# EAGLE design ESP32_LS7366 (EAGLE 9.6.2)
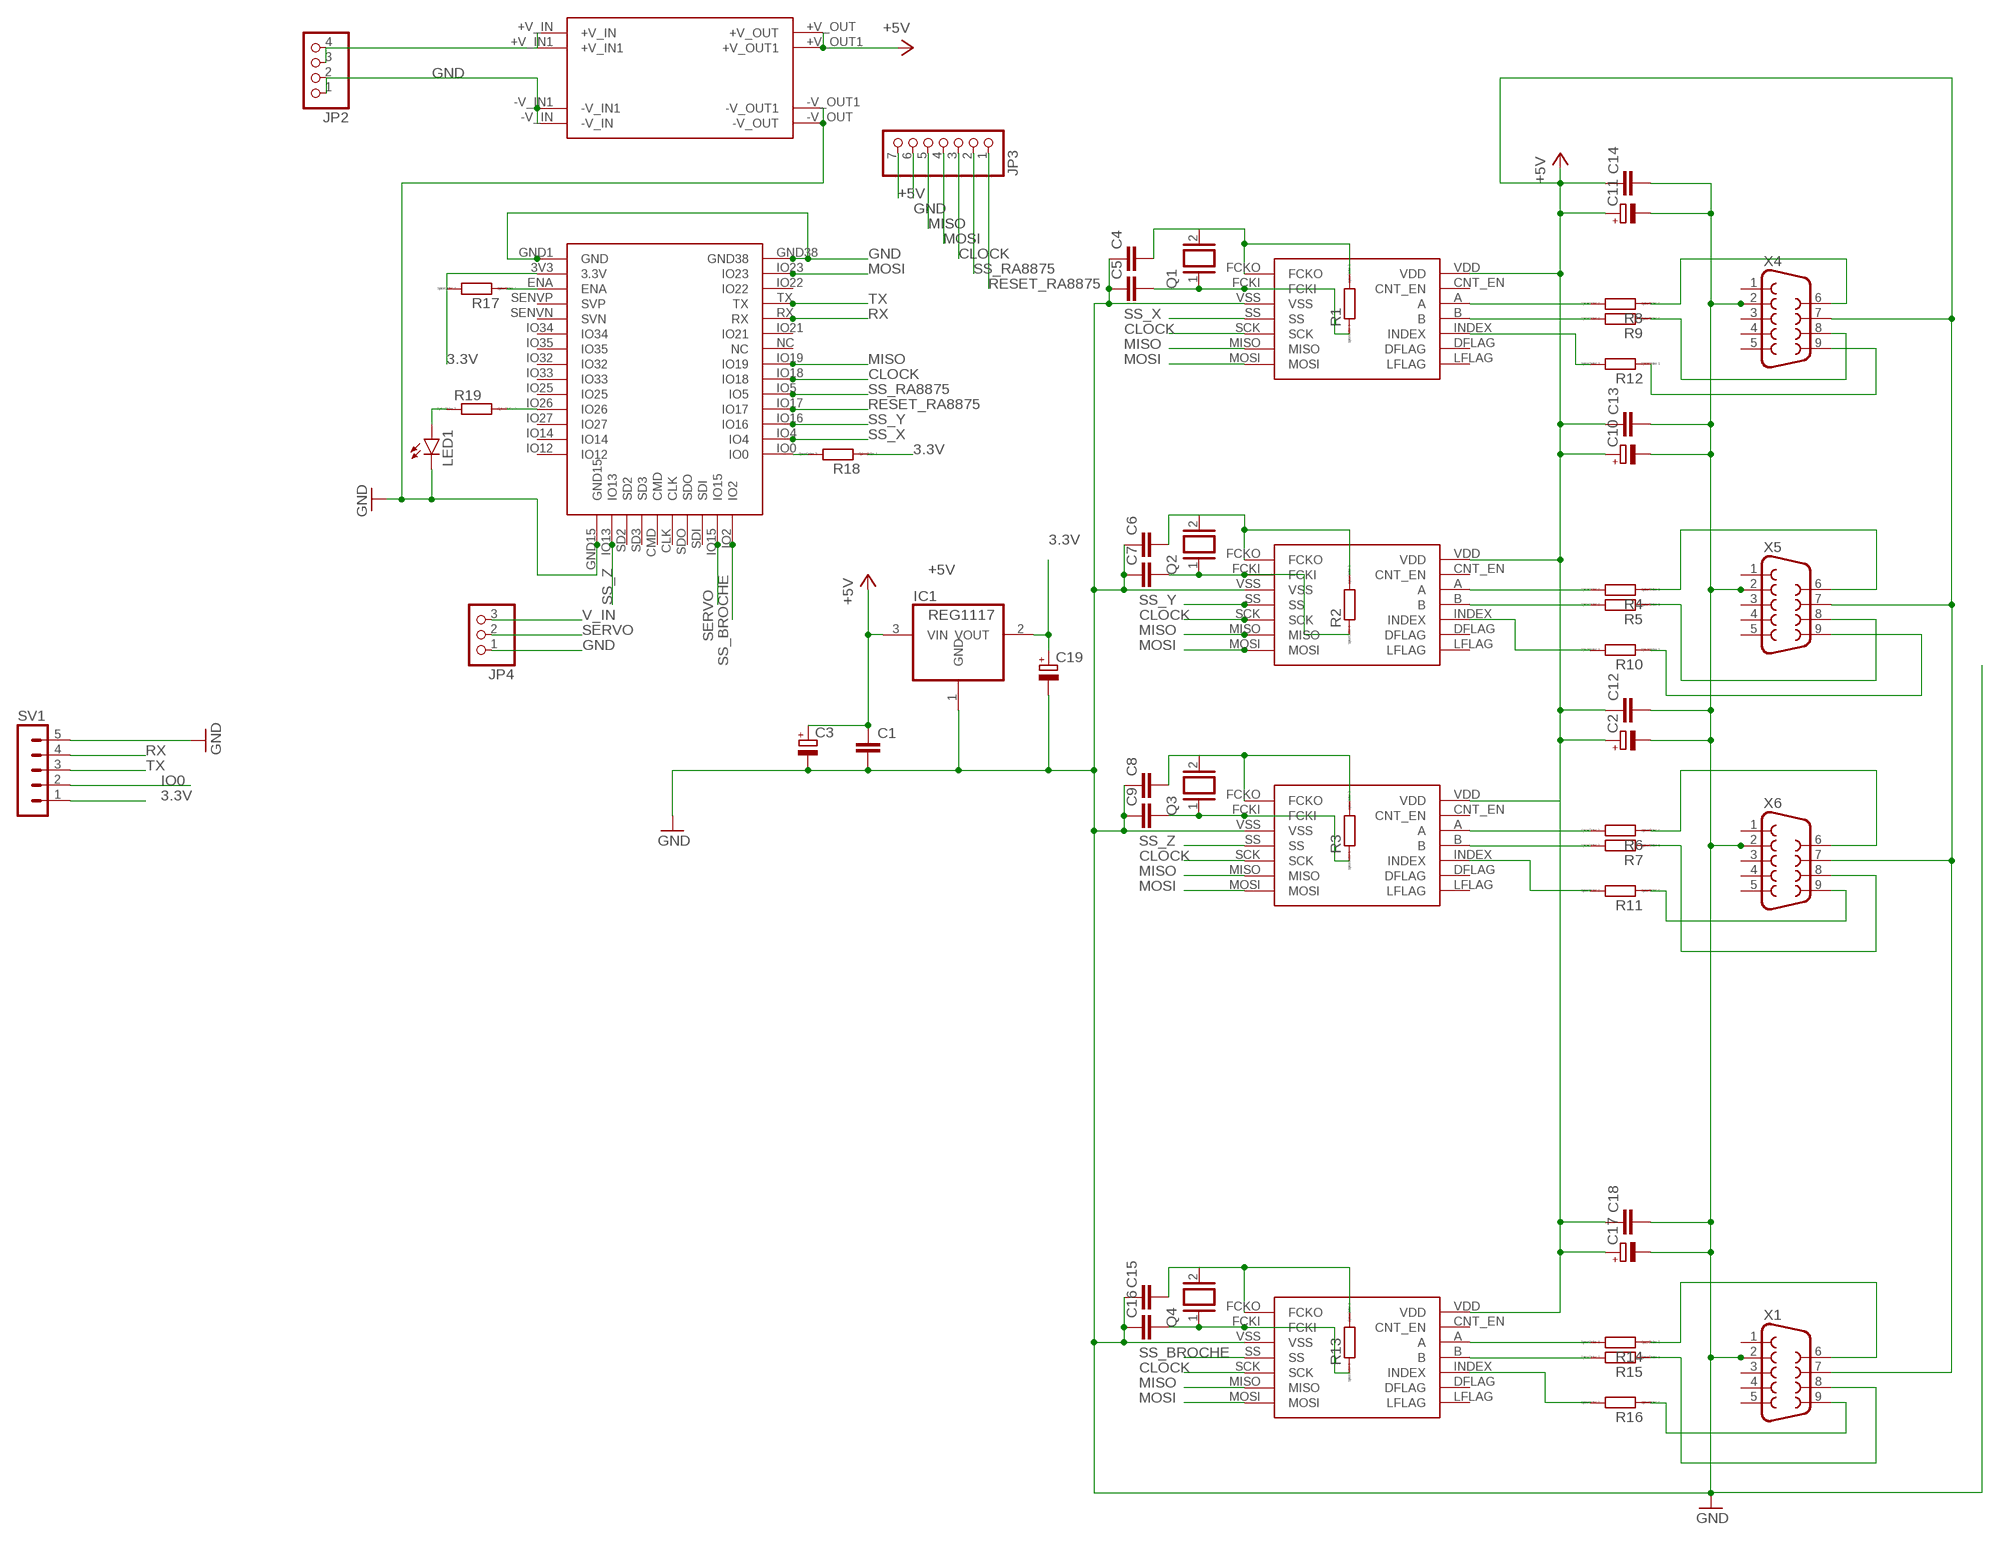
[diagram p0: schematic, sheet 1]

## Parts
C1  C-EU050-035X075  [C050-035X075]
C2  CPOL-EUE5-5  [E5-5]
C3  CPOL-EUE5-5  [E5-5]
C4  C2.5/5  [C2.5-5]
C5  C2.5/5  [C2.5-5]
C6  C2.5/5  [C2.5-5]
C7  C2.5/5  [C2.5-5]
C8  C2.5/5  [C2.5-5]
C9  C2.5/5  [C2.5-5]
C10  CPOL-EUE5-5  [E5-5]
C11  CPOL-EUE5-5  [E5-5]
C12  C-EU050-035X075  [C050-035X075]
C13  C-EU050-035X075  [C050-035X075]
C14  C-EU050-035X075  [C050-035X075]
C15  C2.5/5  [C2.5-5]
C16  C2.5/5  [C2.5-5]
C17  CPOL-EUE5-5  [E5-5]
C18  C-EU050-035X075  [C050-035X075]
C19  CPOL-EUE5-5  [E5-5]
IC1  REG1117  [SOT223]
JP2  PINHD-1X4  [1X04]
JP3  PINHD-1X7  [1X07]
JP4  PINHD-1X3  [1X03]
LED1  LED3MM  [LED3MM]
Q1  XTAL/S  [QS]
Q2  XTAL/S  [QS]
Q3  XTAL/S  [QS]
Q4  XTAL/S  [QS]
R1  R-EU_0207_10  [0207/10]
R2  R-EU_0207_10  [0207/10]
R3  R-EU_0207_10  [0207/10]
R4  R-EU_0207_10  [0207/10]
R5  R-EU_0207_10  [0207/10]
R6  R-EU_0207_10  [0207/10]
R7  R-EU_0207_10  [0207/10]
R8  R-EU_0207_10  [0207/10]
R9  R-EU_0207_10  [0207/10]
R10  R-EU_0207_10  [0207/10]
R11  R-EU_0207_10  [0207/10]
R12  R-EU_0207_10  [0207/10]
R13  R-EU_0207_10  [0207/10]
R14  R-EU_0207_10  [0207/10]
R15  R-EU_0207_10  [0207/10]
R16  R-EU_0207_10  [0207/10]
R17  R-EU_0207_10  [0207/10]
R18  R-EU_0207_10  [0207/10]
R19  R-EU_0207_10  [0207/10]
SV1  MA05-1  [MA05-1]
U$1  LS7366  [DIP14]
U$2  LS7366  [DIP14]
U$3  LS7366  [DIP14]
U$4  LS7366  [DIP14]
U$5  MODULE5V  [MODULE5V]
U$6  ESP32MODULE  [ESP32-MODULE]
X1  F09HP  [F09HP]
X4  F09HP  [F09HP]
X5  F09HP  [F09HP]
X6  F09HP  [F09HP]

## Nets
3.3V: C19.+ IC1.2(VOUT) R17.2 R18.1 SV1.1 U$6.3V3(3.3V)
+5V: C1.1 C2.+ C3.+ C10.+ C11.+ C12.1 C13.1 C14.1 C17.+ C18.1 IC1.3(VIN) JP3.7 U$1.VDD U$2.VDD U$3.VDD U$4.VDD U$5.+V_OUT U$5.+V_OUT1 X1.7 X4.7 X5.7 X6.7
CLOCK: JP3.3 U$1.SCK U$2.SCK U$3.SCK U$4.SCK U$6.IO18
GND: C1.2 C2.- C3.- C4.1 C5.1 C6.1 C7.1 C8.1 C9.1 C10.- C11.- C12.2 C13.2 C14.2 C15.1 C16.1 C17.- C18.2 C19.- IC1.1(GND) JP2.1 JP2.2 JP3.6 JP4.1 LED1.K(C) SV1.5 U$1.VSS U$2.VSS U$3.VSS U$4.VSS U$5.-V_IN U$5.-V_IN1 U$5.-V_OUT U$5.-V_OUT1 U$6.GND1(GND) U$6.GND15 U$6.GND38 X1.2 X4.2 X5.2 X6.2
IO0: R18.2 SV1.2 U$6.IO0
MISO: JP3.5 U$1.MISO U$2.MISO U$3.MISO U$4.MISO U$6.IO19
MOSI: JP3.4 U$1.MOSI U$2.MOSI U$3.MOSI U$4.MOSI U$6.IO23
N$1: R4.1 X5.6
N$2: R19.2 U$6.IO26
N$3: C7.2 Q2.1 R2.1 U$3.FCKI
N$4: LED1.A R19.1
N$5: C9.2 Q3.1 R3.1 U$4.FCKI
N$6: R6.1 X6.6
N$7: R7.1 X6.8
N$8: R5.1 X5.8
N$10: C5.2 Q1.1 R1.1 U$2.FCKI
N$11: R8.1 X4.6
N$12: R9.1 X4.8
N$13: R8.2 U$2.A
N$14: R7.2 U$4.B
N$15: R4.2 U$3.A
N$16: R5.2 U$3.B
N$19: C4.2 Q1.2 R1.2 U$2.FCKO
N$20: C6.2 Q2.2 R2.2 U$3.FCKO
N$21: C8.2 Q3.2 R3.2 U$4.FCKO
N$38: R12.2 U$2.INDEX
N$39: R12.1 X4.9
N$40: R10.2 U$3.INDEX
N$41: R10.1 X5.9
N$42: R11.2 U$4.INDEX
N$43: R11.1 X6.9
N$50: R6.2 U$4.A
N$51: R9.2 U$2.B
N$52: C16.2 Q4.1 R13.1 U$1.FCKI
N$53: R14.1 X1.6
N$54: R15.1 X1.8
N$55: R15.2 U$1.B
N$56: C15.2 Q4.2 R13.2 U$1.FCKO
N$57: R16.2 U$1.INDEX
N$58: R16.1 X1.9
N$59: R14.2 U$1.A
N$61: R17.1 U$6.ENA
RESET_RA8875: JP3.1 U$6.IO17
RX: SV1.4 U$6.RX
SERVO: JP4.2 U$6.IO15
SS_BROCHE: U$1.SS U$6.IO2
SS_RA8875: JP3.2 U$6.IO5
SS_X: U$2.SS U$6.IO4
SS_Y: U$3.SS U$6.IO16
SS_Z: U$4.SS U$6.IO13
TX: SV1.3 U$6.TX
V_IN: JP2.3 JP2.4 JP4.3 U$5.+V_IN U$5.+V_IN1
Unconnected: U$1.CNT_EN U$1.DFLAG U$1.LFLAG U$2.CNT_EN U$2.DFLAG U$2.LFLAG U$3.CNT_EN U$3.DFLAG U$3.LFLAG U$4.CNT_EN U$4.DFLAG U$4.LFLAG U$6.CLK U$6.CMD U$6.IO12 U$6.IO14 U$6.IO21 U$6.IO22 U$6.IO25 U$6.IO27 U$6.IO32 U$6.IO33 U$6.IO34 U$6.IO35 U$6.NC U$6.SD2 U$6.SD3 U$6.SDI U$6.SDO U$6.SENVN(SVN) U$6.SENVP(SVP) X1.1 X1.3 X1.4 X1.5 X4.1 X4.3 X4.4 X4.5 X5.1 X5.3 X5.4 X5.5 X6.1 X6.3 X6.4 X6.5

## Library data of the parts
C1 C12-C14 C18 = rcl:C-EU: CAPACITOR, European symbol; SPICEPREFIX: C
C2 C3 C10 C11 C17 C19 = rcl:CPOL-EU: POLARIZED CAPACITOR, European symbol; SPICEPREFIX: C
C4-C9 C15 C16 = capacitor-wima:C: CAPACITOR naming: grid - package width
IC1 = burr-brown:REG1117: 800mA and 1A Low Dropout (LDO) Positive Regulator 1.8V, 2.5V, 2.85V, 3.3V, 5V, and Adj; MPN: REG1117; OC_FARNELL: 1097566; OC_NEWARK: 14P6981
JP2 = pinhead:PINHD-1X4: PIN HEADER
JP3 = pinhead:PINHD-1X7: PIN HEADER
JP4 = pinhead:PINHD-1X3: PIN HEADER
LED1 = led:LED: LED OSRAM: - CHIPLED LG R971, LG N971, LY N971, LG Q971, LY Q971, LO R971, LY R971 LH N974, LH R974 LS Q976, LO Q976, LY Q976 LO Q996 - Hyper CHIPLED LW Q18S LB Q993, LB Q99A, LB R99A - SideLED LS A670, LO A670, LY A670, LG A670, LP A670 LB A673, LV A673, LT A673, LW A673 LH A674 LY A675 LS A676, LA A676, LO A676, LY A676, LW A676 LS A679, LY A679, LG A679 - Hyper Micro SIDELED® LS Y876, LA Y876, LO Y876, LY Y876 LT Y87S - SmartLED LW L88C, LW L88S LB L89C, LB L89S, LG L890 LS L89K, LO L89K, LY L89K LS L896, LA L896, LO L896, LY L896 - TOPLED LS T670, LO T670, LY T670, LG T670, LP T670 LSG T670, LSP T670, LSY T670, LOP T670, LYG T670 LG T671, LOG T671, LSG T671 LB T673, LV T673, LT T673, LW T673 LH T674 LS T676, LA T676, LO T676, LY T676, LB T676, LH T676, LSB T676, LW T676 LB T67C, LV T67C, LT T67C, LS T67K, LO T67K, LY T67K, LW E67C LS E67B, LA E67B, LO E67B, LY E67B, LB E67C, LV E67C, LT E67C LW T67C LS T679, LY T679, LG T679 LS T770, LO T770, LY T770, LG T770, LP T770 LB T773, LV T773, LT T773, LW T773 LH T774 LS E675, LA E675, LY E675, LS T675 LS T776, LA T776, LO T776, LY T776, LB T776 LHGB T686 LT T68C, LB T68C - Hyper Mini TOPLED® LB M676 - Mini TOPLED Santana® LG M470 LS M47K, LO M47K, LY M47K Source: http://www.osram.convergy.de LUXEON: - LUMILED® LXK2-PW12-R00, LXK2-PW12-S00, LXK2-PW14-U00, LXK2-PW14-V00 LXK2-PM12-R00, LXK2-PM12-S00, LXK2-PM14-U00 LXK2-PE12-Q00, LXK2-PE12-R00, LXK2-PE12-S00, LXK2-PE14-T00, LXK2-PE14-U00 LXK2-PB12-K00, LXK2-PB12-L00, LXK2-PB12-M00, LXK2-PB14-N00, LXK2-PB14-P00, LXK2-PB14-Q00 LXK2-PR12-L00, LXK2-PR12-M00, LXK2-PR14-Q00, LXK2-PR14-R00 LXK2-PD12-Q00, LXK2-PD12-R00, LXK2-PD12-S00 LXK2-PH12-R00, LXK2-PH12-S00 LXK2-PL12-P00, LXK2-PL12-Q00, LXK2-PL12-R00 Source: www.luxeon.com KINGBRIGHT: KA-3528ASYC Source: www.kingbright.com
Q1-Q4 = special:XTAL/S: CRYSTAL
R1-R19 = resistor:R-EU_: RESISTOR, European symbol; SPICEPREFIX: R
SV1 = con-lstb:MA05-1: PIN HEADER; OC_FARNELL: unknown; OC_NEWARK: unknown
U$1-U$4 = ls7366:LS7366
U$5 = STM32:MODULE5V
U$6 = ESP32-DEVKITC:ESP32MODULE
X1 X4-X6 = con-subd:F09: SUB-D; OC_FARNELL: unknown; OC_NEWARK: unknown

## Board
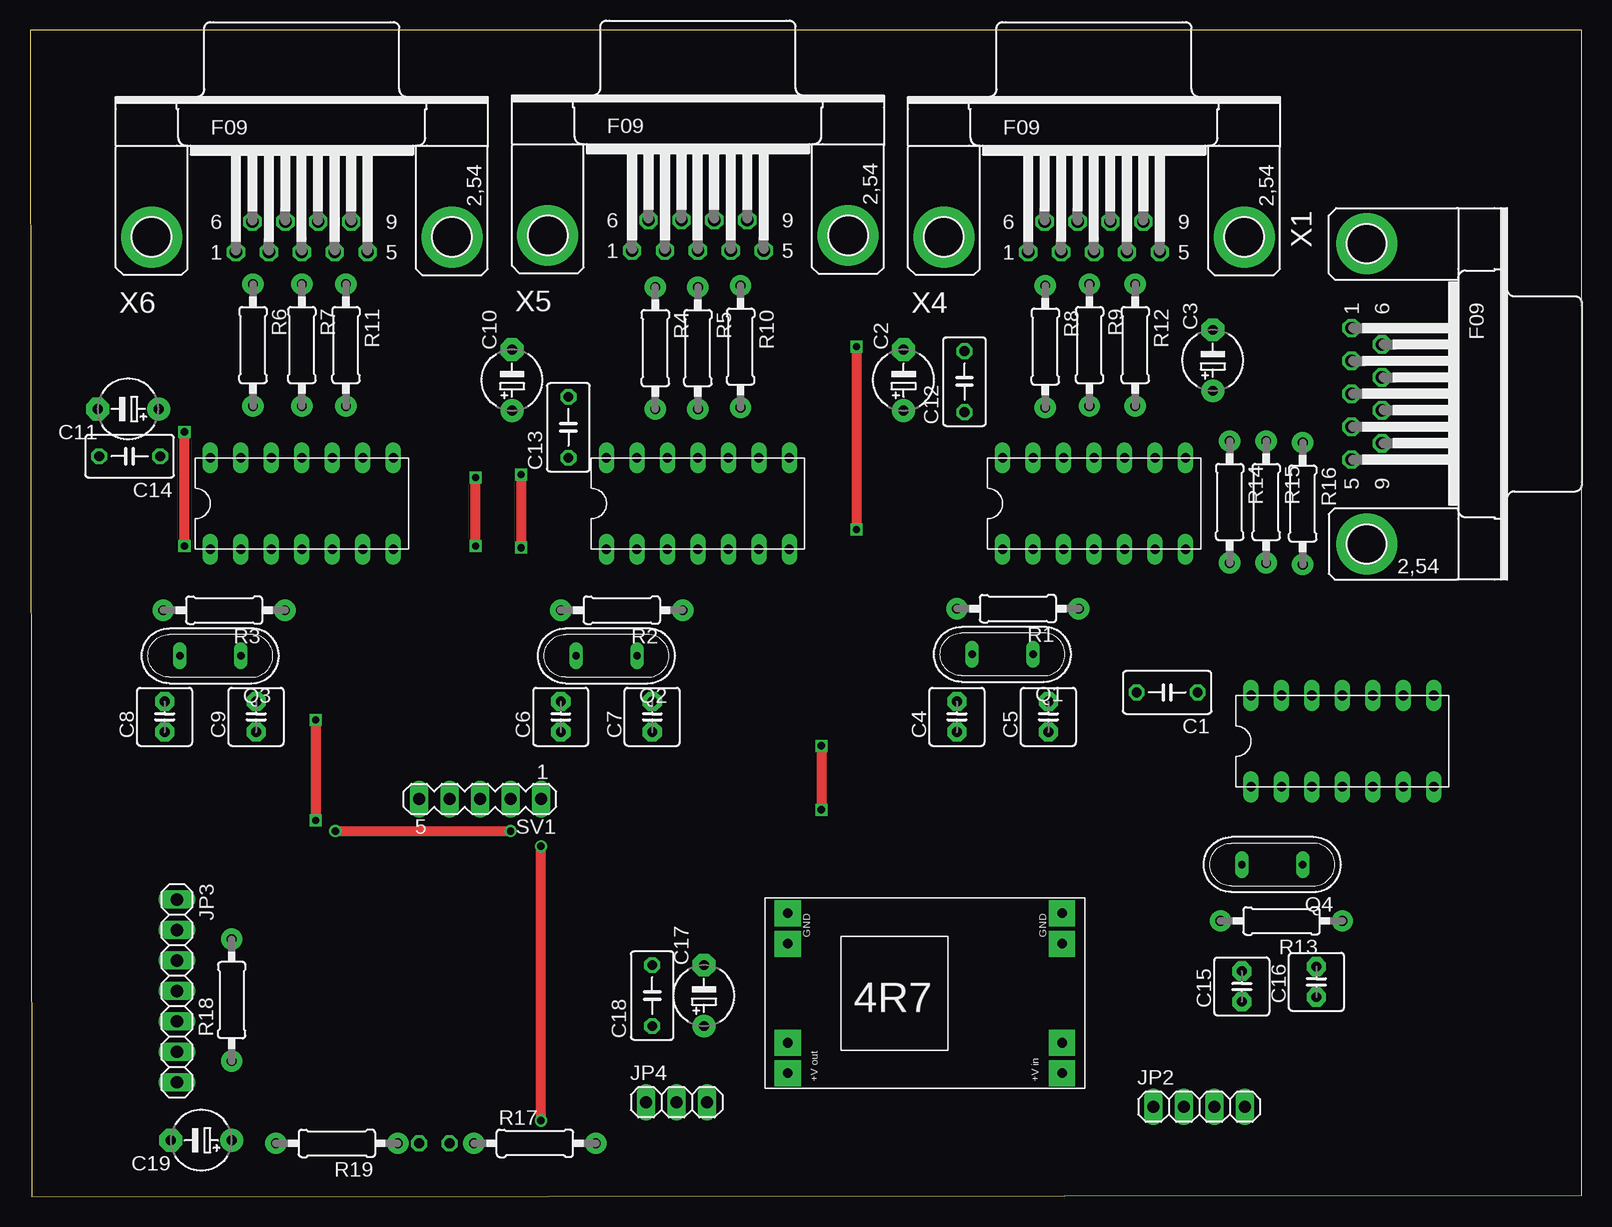
[diagram p1: board, top side]
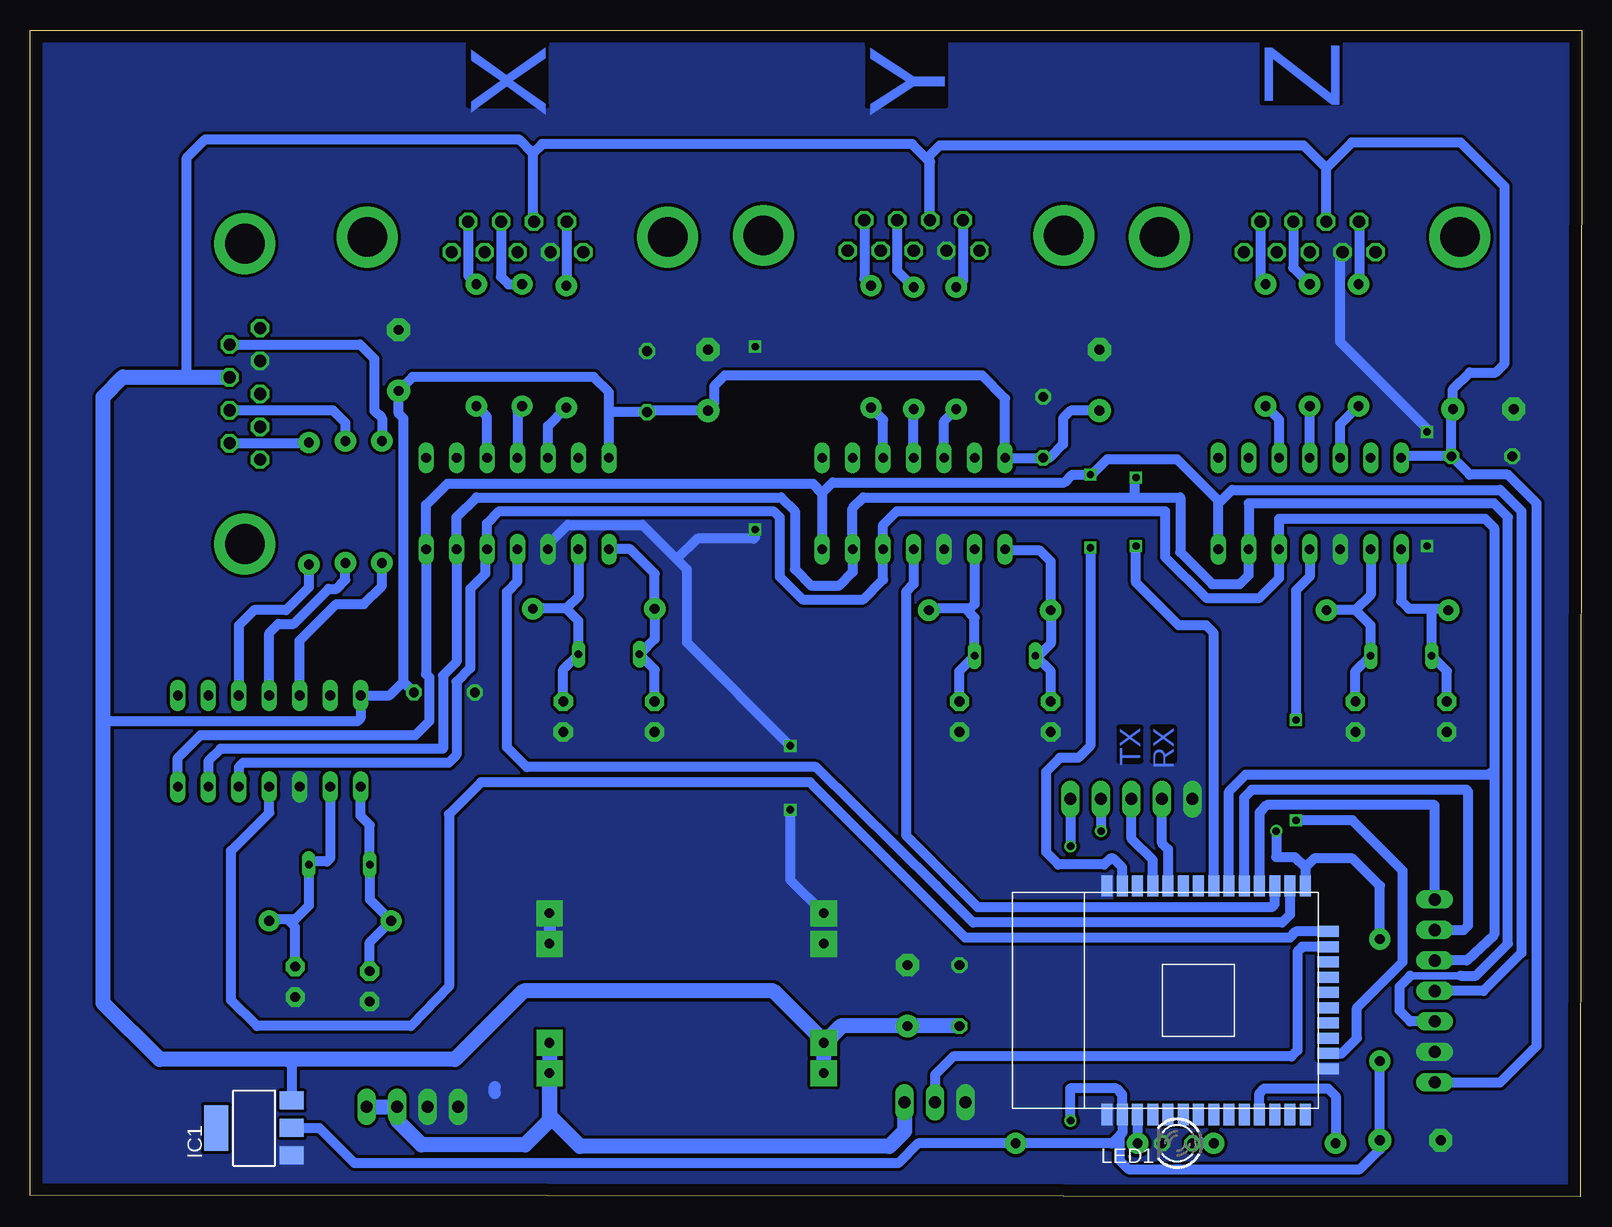
[diagram p2: board, bottom side, seen from below]

Size 129.34 x 97.26 mm. Coordinates in mm from the lower left corner, seen from the top.
Outline: 129.34,0.13 129.34,97.26 0,97.26 0.13,0 129.34,0.13
Copper layers (1*16): Top 0.035mm / dielectric 1.5mm / Bottom 0.035mm
Design rules "ESP32_LS7366": minimum track width 10mil, minimum drill 24mil, track to track 0.205mm, track to pad 0.205mm, pad to pad 0.205mm, via to via 0.205mm, smd to smd 8mil, copper to edge 40mil, drill to drill 8mil, minimum pad ring 10mil, minimum via ring 8mil, stop-mask expansion 4mil, vias tented up to drill 0mil, thermal gap 10mil

### Footprints (pad centres in the part's own frame; a part is rotated, then mirrored left to right if it is on the bottom)
C050-035X075 = drill 0.813 octagon: 1 -2.54,0; 2 2.54,0
E5-5 = drill 0.813 pad 1.905: + -2.54,0 | drill 0.813 pad 1.905 octagon: - 2.54,0
C2.5-5 = drill 0.813 pad 1.6 octagon: 1 -1.27,0; 2 1.27,0
SOT223 = smd 1.499 x 2.007: 1 -2.261,-3.15; 2 0.025,-3.15; 3 2.311,-3.15 | smd 3.81 x 2.007: 4 0,3.15
1X04 = drill 1.016 long: 1 -3.81,0; 2 -1.27,0; 3 1.27,0; 4 3.81,0
1X07 = drill 1.016 long: 1 -7.62,0; 2 -5.08,0; 3 -2.54,0; 4 0,0; 5 2.54,0; 6 5.08,0; 7 7.62,0
1X03 = drill 1.016 long: 1 -2.54,0; 2 0,0; 3 2.54,0
LED3MM = drill 0.813 octagon: A -1.27,0; K 1.27,0
QS = drill 0.61 long: 1 -2.54,0; 2 2.54,0
0207/10 = drill 0.813 pad 1.778: 1 -5.08,0; 2 5.08,0
MA05-1 = drill 1.016 long: 1 -5.08,0; 2 -2.54,0; 3 0,0; 4 2.54,0; 5 5.08,0
DIP14 = drill 0.8 long: A 5.08,5.08; B 7.62,5.08; CNT_EN 2.54,5.08; DFLAG 12.7,5.08; FCKI 2.54,-2.54; FCKO 0,-2.54; INDEX 10.16,5.08; LFLAG 15.24,5.08; MISO 12.7,-2.54; MOSI 15.24,-2.54; SCK 10.16,-2.54; SS 7.62,-2.54; VDD 0,5.08; VSS 5.08,-2.54
MODULE5V = drill 0.8 pad 2.184 square: +V_IN 1.905,-1.27; +V_IN1 1.905,-3.81; +V_OUT 24.765,-1.27; +V_OUT1 24.765,-3.81; -V_IN 1.905,-12.065; -V_IN1 1.905,-14.605; -V_OUT 24.765,-12.065; -V_OUT1 24.765,-14.605
ESP32-MODULE = smd 1.778 x 0.914: 3V3 -9.525,6.35; ENA -9.525,5.08; GND1 -9.525,7.62; GND38 9.525,7.62; IO0 9.525,-8.89; IO4 9.525,-7.62; IO5 9.525,-3.81; IO12 -9.525,-8.89; IO14 -9.525,-7.62; IO16 9.525,-6.35; IO17 9.525,-5.08; IO18 9.525,-2.54; IO19 9.525,-1.27; IO21 9.525,1.27; IO22 9.525,5.08; IO23 9.525,6.35; IO25 -9.525,-3.81; IO26 -9.525,-5.08; IO27 -9.525,-6.35; IO32 -9.525,-1.27; IO33 -9.525,-2.54; IO34 -9.525,1.27; IO35 -9.525,0; NC 9.525,0; RX 9.525,2.54; SENVN -9.525,2.54; SENVP -9.525,3.81; TX 9.525,3.81 | smd 0.914 x 1.778: CLK 0.635,-10.795; CMD -0.635,-10.795; GND15 -5.715,-10.795; IO2 5.715,-10.795; IO13 -4.445,-10.795; IO15 4.445,-10.795; SD2 -3.175,-10.795; SD3 -1.905,-10.795; SDI 3.175,-10.795; SDO 1.905,-10.795
F09HP = drill 1.016 octagon: 1 -5.486,-1.27; 2 -2.743,-1.27; 3 0,-1.27; 4 2.743,-1.27; 5 5.486,-1.27; 6 -4.115,1.27; 7 -1.372,1.27; 8 1.372,1.27; 9 4.115,1.27 | drill 3.302 pad 5.08: G1 -12.522,0; G2 12.522,0

### Placement (x,y rotation side)
C1  94.79,42.04 180 top
C2  72.82,68.07 90 top
C3  98.6,69.72 90 top
C4  77.27,40.01 90 top
C5  84.89,40.01 90 top
C6  44.25,40.01 90 top
C7  51.87,40.01 90 top
C8  11.23,40.01 90 top
C9  18.85,40.01 90 top
C10  40.18,68.07 90 top
C11  8.18,65.66 180 top
C12  77.9,67.94 90 top
C13  44.88,64.14 90 top
C14  8.31,61.72 180 top
C15  101.02,17.53 90 top
C16  107.24,17.91 90 top
C17  56.19,16.76 90 top
C18  51.87,16.76 90 top
C19  14.28,4.7 180 top
IC1  110.67,5.71 90 bottom
JP2  97.46,7.49 0 top
JP3  12.24,17.14 270 top
JP4  53.9,7.87 0 top
LED1  33.71,4.45 180 bottom
Q1  81.08,45.21 180 top
Q2  48.06,45.09 180 top
Q3  15.04,45.09 180 top
Q4  103.56,27.69 180 top
R1  82.35,49.02 180 top
R2  49.33,48.89 180 top
R3  16.18,48.89 180 top
R4  52.12,70.74 270 top
R5  55.68,70.74 270 top
R6  18.59,70.99 270 top
R7  22.66,70.99 270 top
R8  84.63,70.87 270 top
R9  88.32,70.99 270 top
R10  59.23,70.87 270 top
R11  26.34,70.99 270 top
R12  92.13,70.99 270 top
R13  104.32,22.99 180 top
R14  100,57.91 270 top
R15  103.05,57.91 270 top
R16  106.1,57.78 270 top
R17  42.09,4.45 0 top
R18  16.82,16.38 90 top
R19  25.58,4.45 180 top
SV1  37.52,33.15 180 top
U$1  101.78,36.7 0 top
U$2  81.08,56.52 0 top
U$3  48.06,56.52 0 top
U$4  15.04,56.52 0 top
U$5  87.94,9.02 180 top
U$6  31.93,16.38 90 bottom
X1  111.43,66.93 270 top
X4  88.7,80.01 0 top
X5  55.68,80.14 0 top
X6  22.66,80.01 0 top

### Tracks (layer width: path | path; a pad name or v marks a point on that pad's centre or on a via)
3.3V  (via drill 0.61)
  Top 0.813: v42.6,6.35 v42.6,29.21
  Bottom 0.813: IC1.2 107.49,5.71 105.21,5.71 102.29,2.79 56.95,2.79 55.3,4.45 R17.2 39.17,4.45 38.28,5.33 U$6.3V3 | U$6.3V3 38.28,5.29 38.51,5.07 38.51,3.02 37.77,2.29 18.47,2.29 16.82,3.94 C19.+ R18.1 | U$6.3V3 38.28,8.51 38.79,9.02 42.65,9.02 42.65,6.35 v42.6,6.35 | SV1.1 v42.6,29.21
+5V
  Bottom 0.813: 98.22,42.93 98.22,64.9 98.6,65.28 C3.+ 97.46,68.33 82.35,68.33 81.08,67.06 81.08,65.53 | U$2.VDD 81.08,65.53 | 72.95,65.53 C2.+ | 72.95,65.53 72.31,66.17 72.31,67.56 71.42,68.45 49.96,68.45 48.06,66.55 U$3.VDD C13.1 44.37,61.59 43.23,62.74 43.23,64.9 42.6,65.53 C10.+ | 72.95,65.53 77.78,65.53 C12.1 80.95,65.41 81.08,65.53 | X6.7 21.29,85.75 | 21.29,85.75 23.17,87.63 53.52,87.63 54.41,86.74 54.41,81.51 X5.7 54.3,86.26 55.8,87.76 86.67,87.76 87.43,87 | 87.43,87 87.43,81.38 X4.7 | X1.7 115.98,68.3 116.26,68.58 116.26,86.61 114.73,88.14 88.57,88.14 87.43,87 | 21.29,85.75 19.15,87.88 10.08,87.88 6.4,84.2 6.4,69.47 7.16,68.71 9.32,68.71 10.72,67.31 C11.+ 10.85,65.53 C14.1 | C14.1 14.91,61.72 U$4.VDD | 101.65,41.66 U$1.VDD | U$1.VDD 101.78,39.88 102.03,39.62 123.24,39.62 | JP3.7 6.78,9.52 3.73,12.57 3.73,57.78 6.15,60.2 9.32,60.2 C14.1 | 107.87,11.43 107.52,11.07 IC1.3 | 98.22,42.93 C1.1 | U$1.VDD 99.36,41.78 98.22,42.93
  Bottom 1.27: U$5.+V_OUT 63.17,12.7 | 63.17,12.7 U$5.+V_OUT1 | U$5.+V_OUT1 61.77,14.22 C17.+ C18.1 61.65,14.22 63.17,12.7 | U$5.+V_OUT1 63.17,12.95 67.36,17.14 88.19,17.14 93.9,11.43 107.87,11.43 118.54,11.43 123.24,16.13 123.24,39.62 123.24,66.67 121.59,68.33 112.72,68.33 X1.7
CLOCK
  Bottom 0.813: 7.29,35.56 7.29,55.75 8.05,56.52 25.2,56.52 U$4.SCK 25.2,51.56 26.85,49.91 31.29,49.91 34.72,53.34 34.72,57.15 57.07,57.15 58.22,56.01 U$3.SCK 58.22,51.44 59.87,49.78 64.95,49.78 66.85,51.69 66.85,56.64 67.36,57.15 90.22,57.15 91.24,56.13 U$2.SCK 91.36,53.85 91.36,51.94 92.63,50.67 92.63,44.07 93.78,42.93 93.78,36.83 94.41,36.2 111.56,36.2 111.94,35.81 U$1.SCK | 7.29,35.56 7.29,21.84 9.58,19.68 JP3.3 | U$6.IO18 29.39,33.78 27.99,35.18 7.67,35.18 7.29,35.56
GND  (via drill 0.6)
  Top 0.813: v65.96,37.59 v65.96,32.26 | v68.89,70.87 v68.89,55.63 | v12.88,54.23 v12.88,63.75
  Bottom 0.813: U$2.VSS 86.16,54.36 84.51,56.01 78.28,56.01 75.42,53.15 | 75.42,53.15 74.6,52.32 74.6,46.23 v65.96,37.59 | v65.96,32.26 65.96,26.42 U$5.-V_OUT1 | 75.42,53.15 73.71,54.86 69.01,54.86 68.89,54.99 v68.89,55.63 | v12.88,63.75 12.88,64.01 20.12,71.25 20.12,78.54 X6.2
  Bottom 1.016: U$5.-V_IN1 U$5.-V_IN 86.28,20.83 | 90.6,8.64 90.6,9.14
  pour Bottom (isolate 0.254, no thermals): 0.69,0.64 0.69,96.77 129.34,96.26 129.34,0.13
IO0  (via drill 0.61)
  Top 0.813: v25.45,30.48 v40.06,30.48
  Bottom 0.813: R18.2 16.82,25.91 19.1,28.19 22.28,28.19 23.04,27.43 | 23.04,27.43 U$6.IO0 | v25.45,30.48 25.45,28.32 23.93,28.32 23.04,27.43 | SV1.2 v40.06,30.48
MISO  (via drill 0.6)
  Top 0.813: v37.13,54.23 v37.13,59.94
  Bottom 0.61: 14.28,18.41 10.08,18.41
  Bottom 0.813: 37.26,58.29 59.87,58.29 60.76,57.4 U$3.MISO 60.76,52.07 61.9,50.93 64.19,50.93 65.58,52.32 65.58,57.15 66.73,58.29 92.13,58.29 93.78,56.64 U$2.MISO 93.78,44.58 94.92,43.43 94.92,37.34 113.46,37.34 114.48,36.32 U$1.MISO | 37.26,58.29 33.45,58.29 33.45,53.72 30.79,51.05 28.5,51.05 27.74,51.82 U$4.MISO 27.74,57.78 7.29,57.78 6.15,56.64 6.15,21.08 8.81,18.41 10.08,18.41 | JP3.5 14.28,14.6 15.16,15.49 15.16,17.53 14.28,18.41 | v37.13,54.23 37.13,51.18 33.58,47.62 31.29,47.62 30.66,46.99 U$6.IO19 | v37.13,59.94 37.26,59.82 37.26,58.29
MOSI  (via drill 0.6)
  Top 0.813: v40.95,60.2 v40.95,54.1
  Bottom 0.813: U$1.MOSI 117.02,36.58 115.11,38.48 97.21,38.48 96.06,39.62 96.06,43.31 96.32,43.56 U$2.MOSI 96.32,57.66 94.54,59.44 64.06,59.44 63.3,58.67 | 63.3,58.67 U$3.MOSI | JP3.4 8.18,17.14 5,20.32 5,57.15 6.78,58.93 29.13,58.93 30.28,57.78 U$4.MOSI 30.28,58.04 33.71,61.47 39.55,61.47 40.82,60.2 v40.95,60.2 42.48,60.2 43.12,59.55 62.42,59.55 63.3,58.67 | U$6.IO23 38.28,27.43 39.04,28.19 39.29,28.19 39.8,27.69 43.61,27.69 44.63,28.7 44.63,35.43 43.48,36.58 41.96,36.58 40.95,37.59 v40.95,54.1
N$1
  Bottom 0.813: X5.6 51.56,76.38 R4.1
N$2
  Bottom 0.813: U$6.IO26 26.85,8.64 26.47,9.02 21.13,9.02 20.5,8.38 R19.2
N$3
  Bottom 0.813: U$3.FCKI 50.6,49.4 50.98,49.02 51.36,49.02 | 51.36,49.02 54.28,49.02 R2.1 | 51.36,49.02 50.6,48.26 Q2.1 51.87,43.81 C7.2
N$4
  Bottom 0.813: R19.1 LED1.A
N$5
  Bottom 0.813: C9.2 18.85,43.81 Q3.1 17.58,47.62 18.85,48.89 | 18.85,48.89 R3.1 | U$4.FCKI 17.58,50.16 18.85,48.89
N$6
  Bottom 0.813: X6.6 18.54,76.12 R6.1
N$7
  Bottom 0.813: X6.8 24.03,77.44 R7.1
N$8
  Bottom 0.813: X5.8 57.05,77.19 R5.1
N$10
  Bottom 0.813: U$2.FCKI 83.62,50.04 84.63,49.02 | 84.63,49.02 R1.1 | 84.63,49.02 83.62,48.01 Q1.1 84.89,43.94 C5.2
N$11
  Bottom 0.813: R8.1 84.58,76 X4.6
N$12
  Bottom 0.813: X4.8 90.07,76.68 89.46,76.07 R9.1
N$13
  Bottom 0.813: U$2.A 86.16,64.26 R8.2
N$14
  Bottom 0.813: U$4.B R7.2
N$15
  Bottom 0.813: U$3.A 53.14,64.64 R4.2
N$16
  Bottom 0.813: U$3.B R5.2
N$19
  Bottom 0.813: C4.2 77.27,43.94 Q1.2 77.27,46.48 R1.2 77.27,51.94 79.3,53.98 U$2.FCKO
N$20
  Bottom 0.813: C6.2 44.25,43.81 Q2.2 45.26,45.34 45.01,45.34 44.25,46.1 R2.2 44.25,52.96 45.14,53.85 47.93,53.85 U$3.FCKO
N$21
  Bottom 0.813: U$4.FCKO 15.04,49.66 14.4,49.02 12.37,49.02 | 12.37,49.02 11.23,49.02 R3.2 | 12.37,49.02 12.5,48.89 Q3.2 11.23,43.81 C8.2
N$38
  Bottom 0.813: U$2.INDEX 91.24,65.02 R12.2
N$39
  Bottom 0.813: X4.9 92.81,76.76 R12.1
N$40
  Bottom 0.813: U$3.INDEX 58.22,64.77 R10.2
N$41
  Bottom 0.813: X5.9 59.79,76.5 R10.1
N$42
  Bottom 0.813: U$4.INDEX 25.2,64.77 R11.2
N$43
  Bottom 0.813: X6.9 26.77,76.5 R11.1
N$50
  Bottom 0.813: U$4.A 20.12,64.39 R6.2
N$51
  Bottom 0.813: U$2.B 88.7,65.53 R9.2
N$52
  Bottom 0.813: U$1.FCKI 104.32,28.19 104.57,27.94 105.84,27.94 Q4.1 106.1,24.26 107.24,23.11 107.87,23.11 | 107.87,23.11 109.27,23.11 R13.1 | C16.2 107.24,22.48 107.87,23.11
N$53
  Bottom 0.813: X1.6 101.83,71.04 100.64,69.85 100.64,65.53 100,64.9 R14.1
N$54
  Bottom 0.813: X1.8 104.09,65.56 103.05,64.52 R15.1
N$55
  Bottom 0.813: U$1.B 109.4,46.99 108.64,47.75 107.37,47.75 104.45,50.67 103.81,50.67 103.05,51.44 R15.2
N$56
  Bottom 0.813: C15.2 101.02,21.21 R13.2 101.02,24.77 Q4.2 101.02,30.99 101.78,31.75 U$1.FCKO
N$57
  Bottom 0.813: R16.2 106.1,50.8 108,48.89 110.67,48.89 111.94,47.62 U$1.INDEX
N$58
  Bottom 0.813: X1.9 106.15,62.81 R16.1
N$59
  Bottom 0.813: U$1.A 106.86,46.35 103.81,49.4 101.52,49.4 100,50.93 R14.2
N$61
  Bottom 0.813: U$6.ENA R17.1
RESET_RA8875
  Bottom 0.813: U$6.IO17 26.85,32 26.21,32.64 12.24,32.64 JP3.1
RX
  Bottom 0.813: U$6.RX 34.47,28.96 34.98,29.46 SV1.4
SERVO
  Bottom 0.813: JP4.2 53.9,10.16 52.38,11.68 24.18,11.68 23.67,12.19 23.67,20.45 23.29,20.83 U$6.IO15
SS_BROCHE
  Bottom 0.813: U$1.SS 109.4,32 112.57,28.83 112.57,16.38 110.41,14.22 97.59,14.22 94.41,17.53 94.41,31.88 91.75,34.54 64.31,34.54 51.36,21.59 24.31,21.59 23.8,22.1 U$6.IO2
SS_RA8875
  Bottom 0.813: JP3.2 9.83,22.22 9.45,22.61 9.45,33.78 9.58,33.91 27.48,33.91 28.12,33.27 U$6.IO5
SS_X
  Bottom 0.813: U$2.SS 88.7,51.31 89.59,50.42 89.59,37.46 87.94,35.81 63.81,35.81 53.77,25.91 50.72,22.86 24.94,22.86 24.31,23.5 U$6.IO4
SS_Y
  Bottom 0.813: U$6.IO16 25.58,24.38 25.83,24.13 50.32,24.13 56.31,30.12 56.31,50.42 55.68,51.05 U$3.SS
SS_Z  (via drill 0.6)
  Top 0.813: v23.8,39.75 v23.8,31.37
  Bottom 0.813: U$4.SS 22.66,51.69 23.8,50.55 v23.8,39.75 | U$6.IO13 19.99,11.94 18.72,13.21 18.72,15.75 14.91,19.56 14.91,27.18 19.1,31.37 v23.8,31.37
TX
  Bottom 0.813: U$6.TX 35.74,28.07 37.52,29.84 SV1.3
V_IN
  Bottom 1.27: U$5.+V_IN1 U$5.+V_IN | JP2.4 JP2.3 98.73,6.35 96.7,4.32 88.06,4.32 86.03,6.35 U$5.+V_IN | JP4.3 56.44,5.46 57.71,4.19 83.49,4.19 86.03,6.73 U$5.+V_IN

### Text on the board
Bottom: Z | Y | X | RX | TX